# EAGLE design schematic (EAGLE 6.5.0)
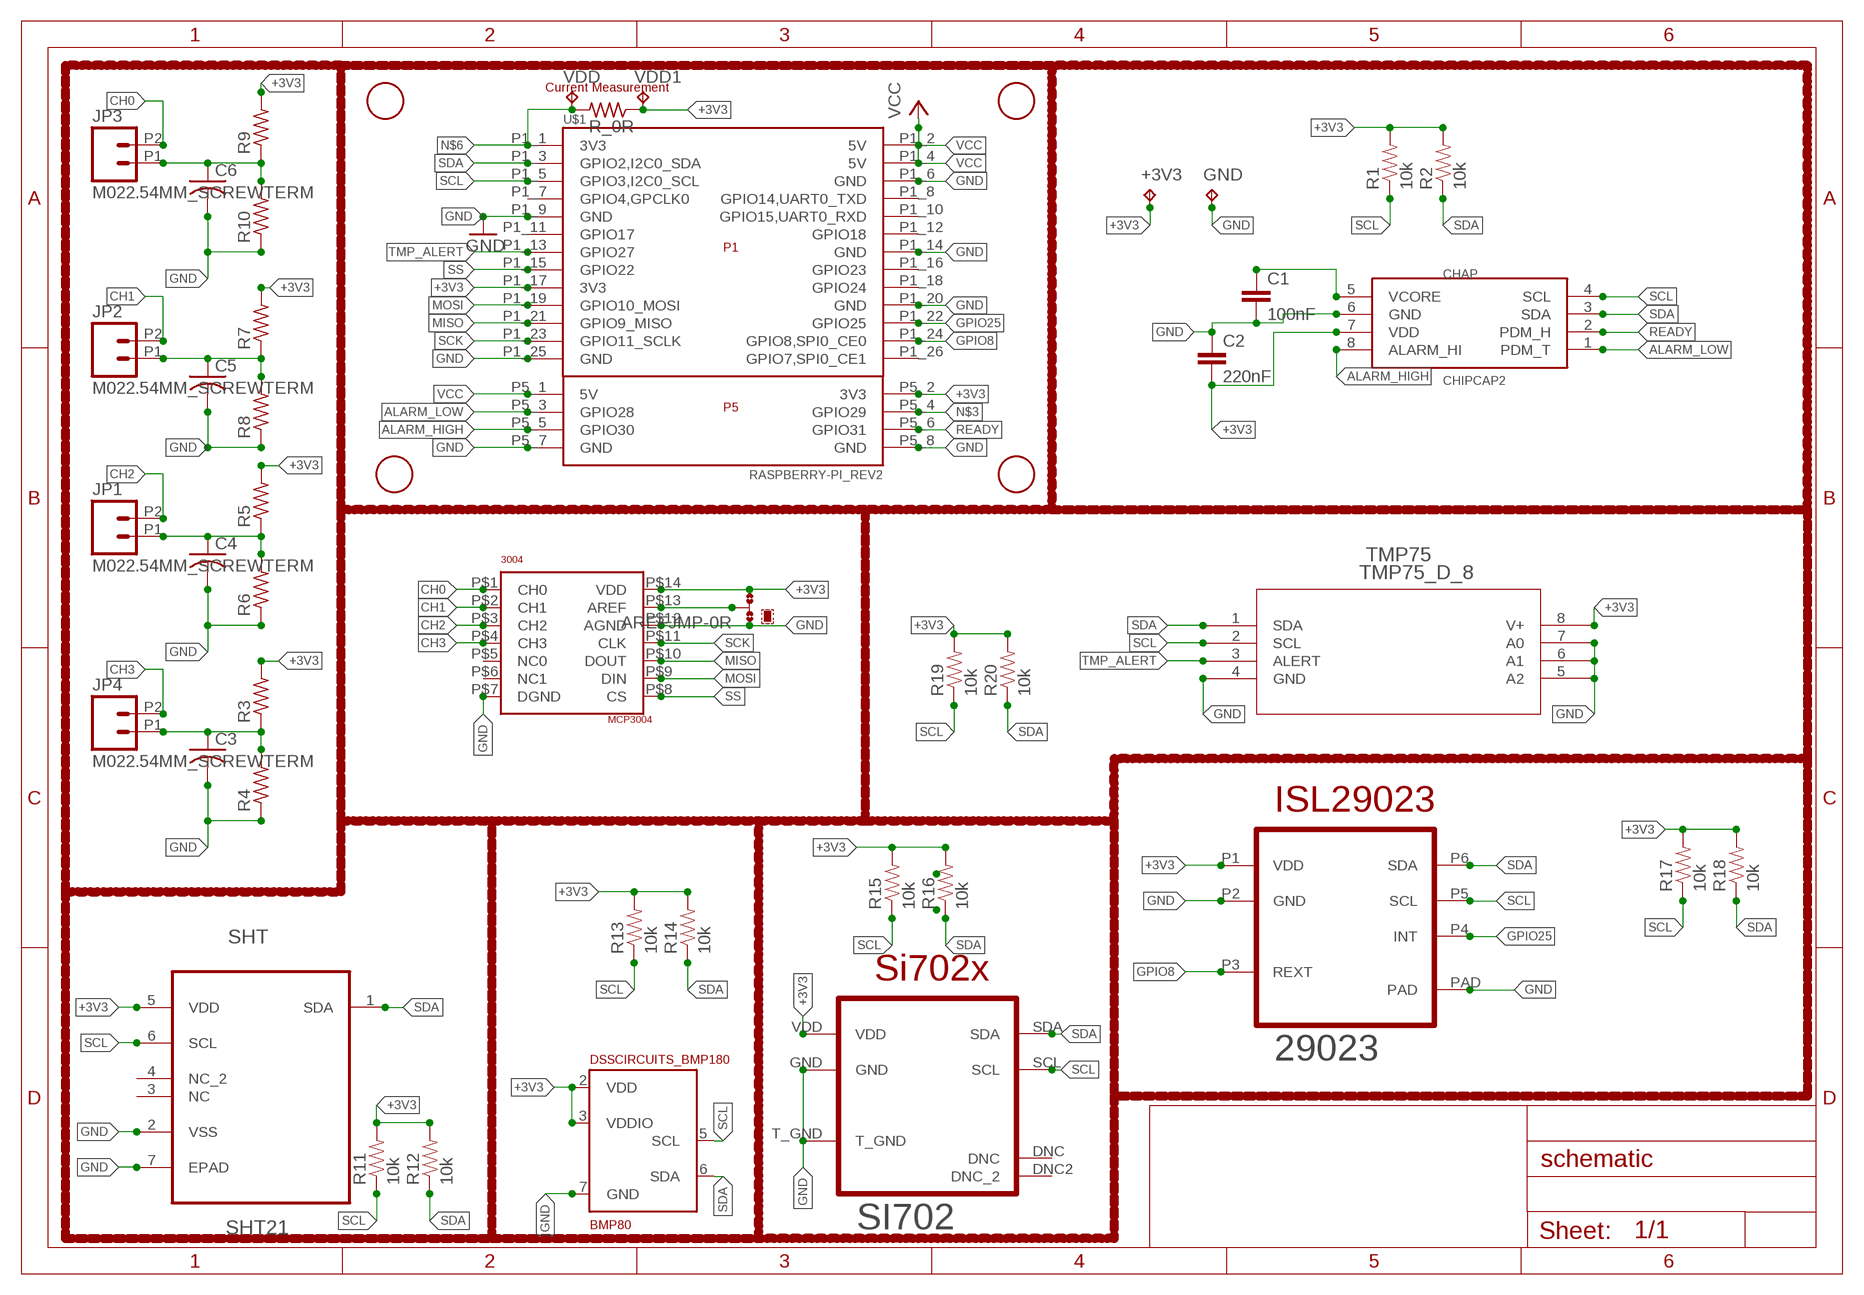
[diagram p0: schematic, sheet 1]

## Parts
3004  MCP3004  [TSSOP14_4MM4]
29023  ISL29023  [ODFN6]
+3V3  TPTP20R  [TP20R]
AREFJMP  0R-JUMPA  [A0R-JMP]
BMP80  DSSCIRCUITS_BMP180  [DSSCIRCUITS_LGA7]
C1  100nF  CAP0402-CAP  [0402-CAP]
C2  220nF  CAP0402-CAP  [0402-CAP]
C3  C-USC0402  [C0402]
C4  C-USC0402  [C0402]
C5  C-USC0402  [C0402]
C6  C-USC0402  [C0402]
CHAP  CHIPCAP2  [CHIPCAP2]
GND  TPTP20R  [TP20R]
JP1  M022.54MM_SCREWTERM  [1X02_2.54_SCREWTERM]
JP2  M022.54MM_SCREWTERM  [1X02_2.54_SCREWTERM]
JP3  M022.54MM_SCREWTERM  [1X02_2.54_SCREWTERM]
JP4  M022.54MM_SCREWTERM  [1X02_2.54_SCREWTERM]
R1  10k  RESISTOR0603  [0603-RES]
R2  10k  RESISTOR0603  [0603-RES]
R3  R-US_R0402  [R0402]
R4  R-US_R0402  [R0402]
R5  R-US_R0402  [R0402]
R6  R-US_R0402  [R0402]
R7  R-US_R0402  [R0402]
R8  R-US_R0402  [R0402]
R9  R-US_R0402  [R0402]
R10  R-US_R0402  [R0402]
R11  10k  RESISTOR0603  [0603-RES]
R12  10k  RESISTOR0603  [0603-RES]
R13  10k  RESISTOR0603  [0603-RES]
R14  10k  RESISTOR0603  [0603-RES]
R15  10k  RESISTOR0603  [0603-RES]
R16  10k  RESISTOR0603  [0603-RES]
R17  10k  RESISTOR0603  [0603-RES]
R18  10k  RESISTOR0603  [0603-RES]
R19  10k  RESISTOR0603  [0603-RES]
R20  10k  RESISTOR0603  [0603-RES]
R_0R  R-US_R0402  [R0402]
SHT  SHT21  [DFN300X300X110-7N]
SI702  SI702X  [DFN6]
TMP75  TMP75_D_8  [D8]
U$1  RASPBERRY-PI_REV2  [RASPBERRY-PI_REV2]
U$2  FIDUCIAL  [FIDUCIAL_1MM]
U$3  FIDUCIAL  [FIDUCIAL_1MM]
U$4  FIDUCIAL  [FIDUCIAL_1MM]
U$5  FIDUCIAL  [FIDUCIAL_1MM]
VDD  TPTP20R  [TP20R]
VDD1  TPTP20R  [TP20R]

## Nets
+3V3 [PWR]: 3004.P$14(VDD) 29023.P1(VDD) +3V3.TP AREFJMP.3 BMP80.2(VDD) BMP80.3(VDDIO) C2.2 CHAP.7(VDD) R1.2 R2.2 R3.2 R5.2 R7.2 R9.2 R11.2 R12.2 R13.2 R14.2 R15.2 R16.2 R17.2 R18.2 R19.2 R20.2 R_0R.1 SHT.5(VDD) SI702.VDD TMP75.8(V+) U$1.P1_17(3V3) U$1.P5_2(3V3) VDD1.TP
ALARM_HIGH: CHAP.8(ALARM_HI) U$1.P5_5(GPIO30)
ALARM_LOW: CHAP.1(PDM_T) U$1.P5_3(GPIO28)
CH0: 3004.P$1(CH0) JP3.P2
CH1: 3004.P$2(CH1) JP2.P2
CH2: 3004.P$3(CH2) JP1.P2
CH3: 3004.P$4(CH3) JP4.P2
GND [PWR]: 3004.P$7(DGND) 3004.P$12(AGND) 29023.P2(GND) 29023.PAD AREFJMP.1 BMP80.7(GND) C1.2 C2.1 C3.2 C4.2 C5.2 C6.2 CHAP.6(GND) GND.TP R4.1 R6.1 R8.1 R10.1 SHT.2(VSS) SHT.7(EPAD) SI702.GND SI702.T_GND TMP75.4(GND) TMP75.5(A2) TMP75.6(A1) TMP75.7(A0) U$1.P1_6(GND) U$1.P1_9(GND) U$1.P1_14(GND) U$1.P1_20(GND) U$1.P1_25(GND) U$1.P5_7(GND) U$1.P5_8(GND)
GPIO8: 29023.P3(REXT) U$1.P1_24(GPIO8,SPI0_CE0)
GPIO25: 29023.P4(INT) U$1.P1_22(GPIO25)
MISO: 3004.P$10(DOUT) U$1.P1_21(GPIO9_MISO)
MOSI: 3004.P$9(DIN) U$1.P1_19(GPIO10_MOSI)
N$1: C4.1 JP1.P1 R5.1 R6.2
N$2: C5.1 JP2.P1 R7.1 R8.2
N$3: U$1.P5_4(GPIO29)
N$4: C6.1 JP3.P1 R9.1 R10.2
N$5: C1.1 CHAP.5(VCORE)
N$6 [PWR]: R_0R.2 U$1.P1_1(3V3) VDD.TP
N$12: C3.1 JP4.P1 R3.1 R4.2
N$17: 3004.P$13(AREF) AREFJMP.2
READY: CHAP.2(PDM_H) U$1.P5_6(GPIO31)
SCK: 3004.P$11(CLK) U$1.P1_23(GPIO11_SCLK)
SCL: 29023.P5(SCL) BMP80.5(SCL) CHAP.4(SCL) R1.1 R11.1 R13.1 R15.1 R17.1 R19.1 SHT.6(SCL) SI702.SCL TMP75.2(SCL) U$1.P1_5(GPIO3,I2C0_SCL)
SDA: 29023.P6(SDA) BMP80.6(SDA) CHAP.3(SDA) R2.1 R12.1 R14.1 R16.1 R18.1 R20.1 SHT.1(SDA) SI702.SDA TMP75.1(SDA) U$1.P1_3(GPIO2,I2C0_SDA)
SS: 3004.P$8(CS) U$1.P1_15(GPIO22)
TMP_ALERT: TMP75.3(ALERT) U$1.P1_13(GPIO27)
VCC [PWR]: U$1.P1_2(5V) U$1.P1_4(5V) U$1.P5_1(5V)
Unconnected: 3004.P$5(NC0) 3004.P$6(NC1) BMP80.1 BMP80.4 SHT.3(NC) SHT.4(NC_2) SI702.DNC SI702.DNC2(DNC_2) U$1.P1_7(GPIO4,GPCLK0) U$1.P1_8(GPIO14,UART0_TXD) U$1.P1_10(GPIO15,UART0_RXD) U$1.P1_11(GPIO17) U$1.P1_12(GPIO18) U$1.P1_16(GPIO23) U$1.P1_18(GPIO24) U$1.P1_26(GPIO7,SPI0_CE1)

## Notes on the sheet
- Current Measurement

## Library data of the parts
3004 = lib:MCP3004: The Microchip Technology Inc. MCP3004/3008 devices are successive approximation 10-bit Analogto-Digital (A/D) converters with on-board sample and hold circuitry. The MCP3004 is programmable to provide two pseudo-differential input pairs or four single-ended inputs. The MCP3008 is programmable to provide four pseudo-differential input pairs or eight single-ended inputs. Differential Nonlinearity (DNL) and Integral Nonlinearity (INL) are specified at ±1 LSB. Communication with the devices is accomplished using a simple serial interface compatible with the SPI protocol. The devices are capable of conversion rates of up to 200 ksps. The MCP3004/3008 devices operate over a broad voltage range (2.7V - 5.5V). Low-current design permits operation with typical standby currents of only 5 nA and typical active currents of 320 µA. The MCP3004 is offered in 14-pin PDIP, 150 mil SOIC and TSSOP packages, while the MCP3008 is offered in 16-pin PDIP and SOIC packages. Features • 10-bit resolution • ± 1 LSB max DNL • ± 1 LSB max INL • 4 (MCP3004) or 8 (MCP3008) input channels • Analog inputs programmable as single-ended or pseudo-differential pairs • On-chip sample and hold • SPI serial interface (modes 0,0 and 1,1) • Single supply operation: 2.7V - 5.5V • 200 ksps max. sampling rate at VDD=5V • 75 ksps max. sampling rate at VDD=2.7V • Low power CMOS technology • 5 nA typical standby current, 2 µA max. • 500 µA max. active current at 5V • Industrial temp range: -40°C to +85°C • Available in PDIP, SOIC and TSSOP packages
29023 = weatherpilot_lbr:ISL29023
+3V3 GND VDD VDD1 = testpad:TP: Test pad
AREFJMP = jump-0r-smd:0R-JUMP: SMD 0R 0805 Jumper
BMP80 = BMP180_Breakout_PCB_Rev_B:DSSCIRCUITS_BMP180
C1 C2 = weatherpilot_lbr:CAP: Capacitor Standard 0603 ceramic capacitor, and 0.1" leaded capacitor.
C3-C6 = rcl:C-US: CAPACITOR, American symbol
CHAP = lib:CHIPCAP2
JP1-JP4 = SparkFun-Connectors:M02: Standard 2-pin 0.1" header. Use with - straight break away headers ( PRT-00116) - right angle break away headers (PRT-00553) - swiss pins (PRT-00743) - machine pins (PRT-00117) - female headers (PRT-00115) Molex polarized connector foot print use with: PRT-08233 with associated crimp pins and housings. 2.54_SCREWTERM for use with PRT-10571. 3.5mm Screw Terminal footprints for PRT-08084 5mm Screw Terminal footprints for use with PRT-08433
R1 R2 R11-R20 = SparkFun-Resistors:RESISTOR: Resistor Basic schematic elements and footprints for 0603, 1206, and PTH resistors.
R3-R10 R_0R = rcl:R-US_: RESISTOR, American symbol
SHT = weatherpilot_lbr:SHT21: SENSOR, HUMIDITY & TEMP; MPN: SHT21; OC_FARNELL: 1855468; OC_NEWARK: 20T1172; PACKAGE: DFN-6; SUPPLIER: SENSIRION
SI702 = weatherpilot_lbr:SI702X
TMP75 = libraryPart:TMP75_D_8; DATASHEETURL: http://www.ti.com/lit/gpn/TMP75; DESCRIPTION: Digital Temperature Sensor with 2-Wire Interface; FAMILY_NAME: TEMPERATURE SENSOR; GENERIC_PART_NUMBER: TMP75; INDUSTRY_STD_PKG_TYPE: SOIC; MANUFACTURER: Texas Instruments; MANUFACTURER_PART_NUMBER: tmp75_d_8; PACKAGE_DESIGNATOR: D; PIN_COUNT: 8; VENDOR: Texas Instruments
U$1 = RaspberryPi:RASPBERRY-PI_REV2: Raspberry Pi Board <http://www.raspberrypi.org/> Jacques Lagnel V1.0 (beta) 2012 Mateusz Bawaj V1.1 (beta) 2012 Board dimension: Forum 3D model <http://www.raspberrypi.org/forum/general-discussion/mechanical-profile-3d-models?value=3d%20model&type=1&include=1&search=1&ret=all> The GPIO Connector (P1): http://elinux.org/RPi_Low-level_peripherals The GPIO Connector (P5): http://www.raspberrypi-spy.co.uk/2012/09/raspberry-pi-p5-header/
U$2-U$5 = adafruit:FIDUCIAL: For use by pick and place machines to calibrate the vision/machine, 1mm By microbuilder.eu

## Net classes
0 default: width 0.203 mm, drill 0.305 mm, clearance 0.152 mm
1 PWR: width 0.203 mm, drill 0.305 mm, clearance 0.152 mm

## Board
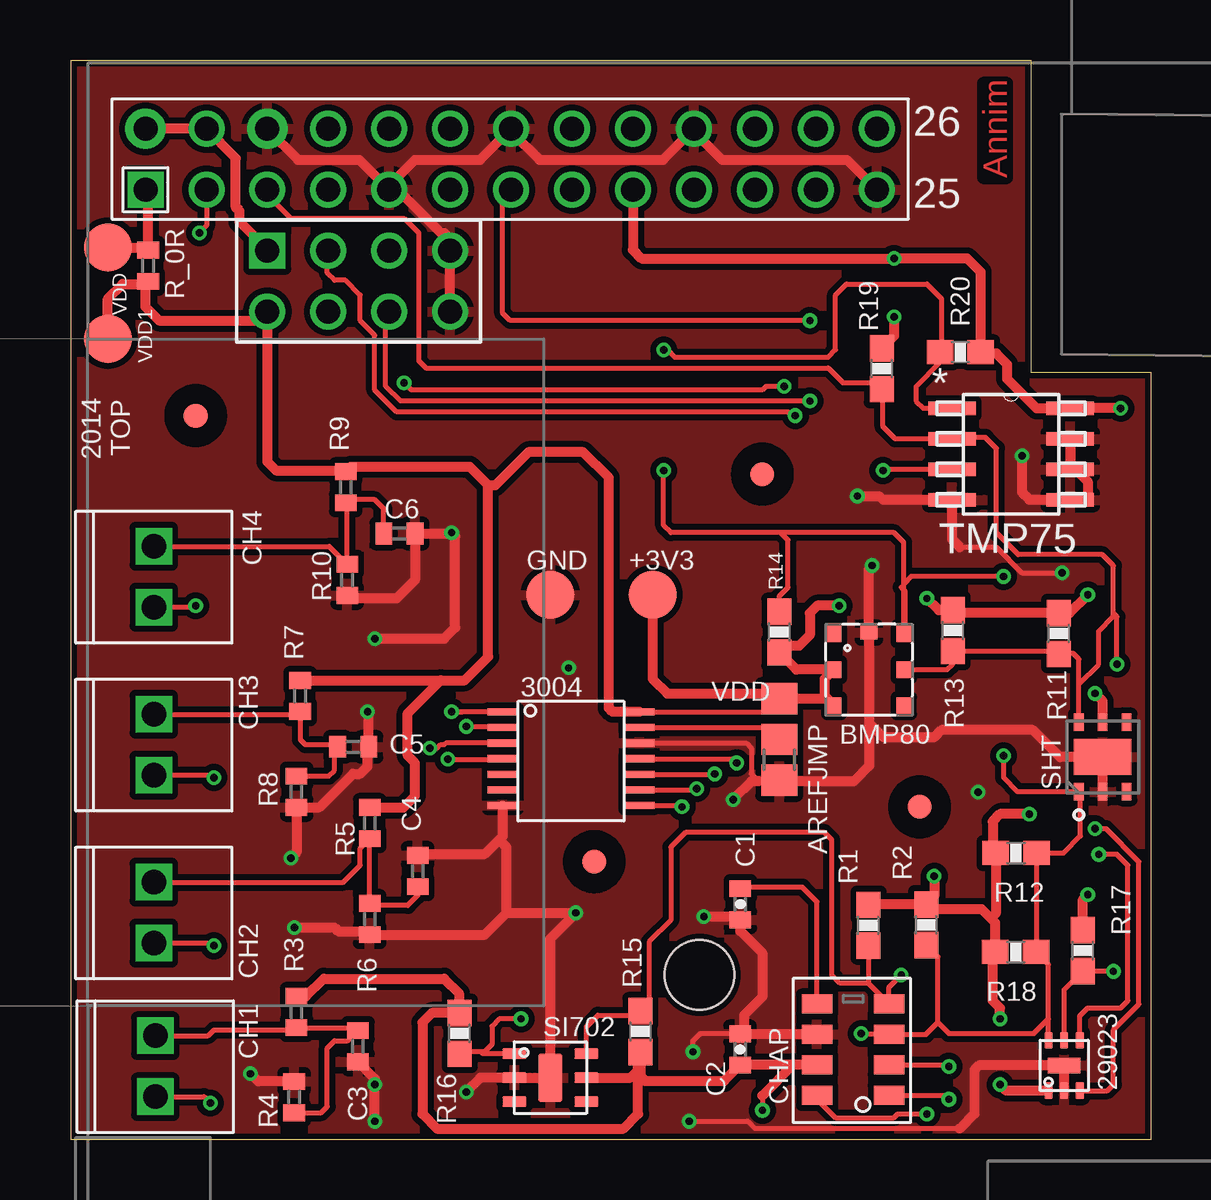
[diagram p1: board, top side]
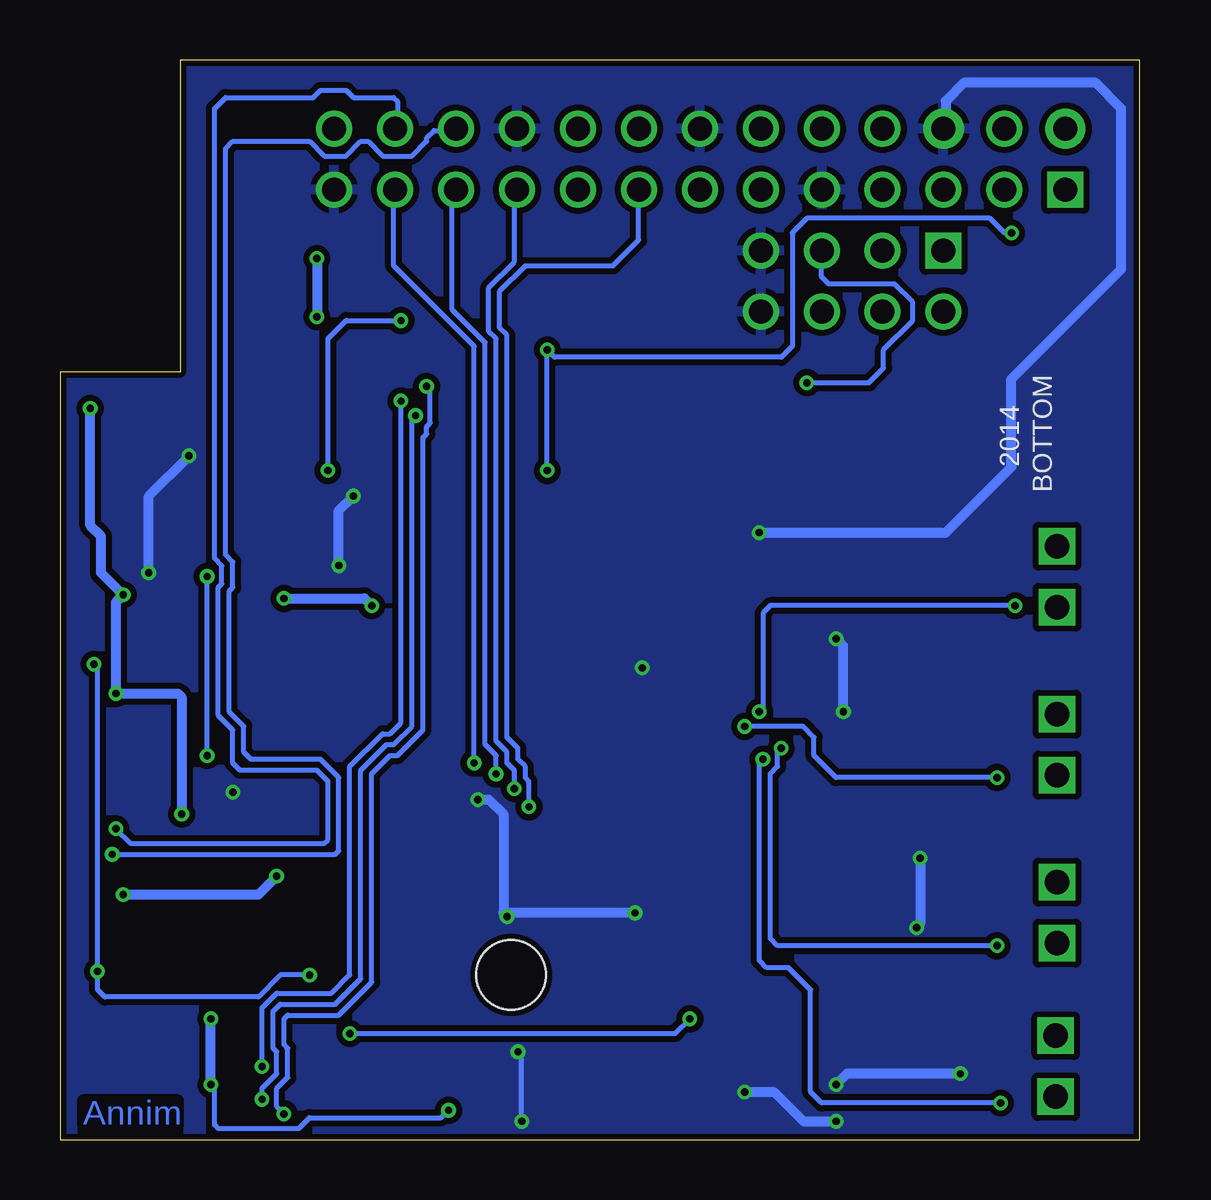
[diagram p2: board, bottom side, seen from below]

Size 45 x 45 mm. Coordinates in mm from the lower left corner, seen from the top.
Outline: 0,0 0,45 40,45 40,32 45,32 45,0 0,0
Copper layers (1*16): Top 0.035mm / dielectric 1.5mm / Bottom 0.035mm
Design rules "smart prototyping": minimum track width 6mil, minimum drill 12mil, track to track 6mil, track to pad 6mil, pad to pad 6mil, via to via 6mil, smd to smd 0mil, copper to edge 10mil, drill to drill 10mil, minimum pad ring 6mil, minimum via ring 6mil, stop-mask expansion 2mil, vias tented up to drill 25mil, thermal gap 10mil

### Footprints (pad centres in the part's own frame; a part is rotated, then mirrored left to right if it is on the bottom)
TSSOP14_4MM4 = smd 1.25 x 0.3: P$1 -0.65,4.55; P$2 -0.65,3.9; P$3 -0.65,3.25; P$4 -0.65,2.6; P$5 -0.65,1.95; P$6 -0.65,1.3; P$7 -0.65,0.65; P$8 5.05,0.65; P$9 5.05,1.3; P$10 5.05,1.95; P$11 5.05,2.6; P$12 5.05,3.25; P$13 5.05,3.9; P$14 5.05,4.55
ODFN6 = smd 0.7 x 0.35: P1 -1.05,0.65; P2 -1.05,0; P3 -1.05,-0.65; P4 1.05,-0.65; P5 1.05,0; P6 1.05,0.65 | smd 0.65 x 1.35: PAD 0,0
TP20R = smd 2 x 2: TP 0,0
A0R-JMP = smd 1.5 x 1.3: 1 0,1.7; 2 0,0; 3 0,-1.7
DSSCIRCUITS_LGA7 = smd 0.7 x 0.6: 1 -1.5,-1.45; 2 0,-1.45; 3 1.5,-1.45; 4 1.5,1.45; 5 0,1.45; 6 -1.5,1.45 | smd 0.6 x 0.7: 7 -1.55,0
0402-CAP = smd 0.7 x 0.9: 1 -0.65,0; 2 0.65,0
C0402 = smd 0.7 x 0.9: 1 -0.65,0; 2 0.65,0
CHIPCAP2 = smd 1.27 x 0.8: 1 1.603,-1.651; 2 1.603,-0.381; 3 1.603,0.889; 4 1.603,2.159; 5 -1.397,2.159; 6 -1.397,0.889; 7 -1.397,-0.381; 8 -1.397,-1.651
1X02_2.54_SCREWTERM = drill 1.016 square: P1 2.54,0; P2 0,0
0603-RES = smd 1.1 x 1: 1 -0.85,0; 2 0.85,0
R0402 = smd 0.7 x 0.9: 1 -0.65,0; 2 0.65,0
DFN300X300X110-7N = smd 0.711 x 0.406: 1 -1.448,0.991; 2 -1.448,0; 3 -1.448,-0.991; 4 1.448,-0.991; 5 1.448,0; 6 1.448,0.991 | smd 1.499 x 2.388: 7 0,0
DFN6 = smd 1 x 0.45: DNC -1.5,-1; DNC2 1.5,-1; GND -1.5,0; SCL 1.5,1; SDA -1.5,1; VDD 1.5,0 | smd 1 x 2: T_GND 0,0
D8 = smd 1.981 x 0.559: 1 -2.464,1.905; 2 -2.464,0.635; 3 -2.464,-0.635; 4 -2.464,-1.905; 5 2.464,-1.905; 6 2.464,-0.635; 7 2.464,0.635; 8 2.464,1.905
RASPBERRY-PI_REV2 = drill 1 square: P1_1 -41.91,21.59; P5_1 -36.83,19.05 | drill 1 pad 1.676: P1_2 -41.91,24.13; P1_6 -36.83,24.13 | drill 1: P1_3 -39.37,21.59; P1_4 -39.37,24.13; P1_5 -36.83,21.59; P1_7 -34.29,21.59; P1_8 -34.29,24.13; P1_9 -31.75,21.59; P1_10 -31.75,24.13; P1_11 -29.21,21.59; P1_12 -29.21,24.13; P1_13 -26.67,21.59; P1_14 -26.67,24.13; P1_15 -24.13,21.59; P1_16 -24.13,24.13; P1_17 -21.59,21.59; P1_18 -21.59,24.13; P1_19 -19.05,21.59; P1_20 -19.05,24.13; P1_21 -16.51,21.59; P1_22 -16.51,24.13; P1_23 -13.97,21.59; P1_24 -13.97,24.13; P1_25 -11.43,21.59; P1_26 -11.43,24.13; P5_2 -36.83,16.51; P5_3 -34.29,19.05; P5_4 -34.29,16.51; P5_5 -31.75,19.05; P5_6 -31.75,16.51; P5_7 -29.21,19.05; P5_8 -29.21,16.51 | hole 2.9: -18.81,-11.135
FIDUCIAL_1MM = smd 1 x 1: 1 0,0

### Placement (x,y rotation side)
3004  18.63,13.27 0 top
29023  41.38,3.09 90 top
+3V3  24.23,22.71 0 top
AREFJMP  29.51,16.68 180 top
BMP80  33.25,19.59 270 top
C1  27.88,9.81 270 top
C2  27.88,3.76 270 top
C3  11.95,3.89 270 top
C4  14.44,11.19 90 top
C5  11.75,16.37 0 top
C6  13.67,25.26 0 top
CHAP  32.48,3.49 0 top
GND  19.96,22.71 0 top
JP1  3.44,8.19 90 top
JP2  3.44,15.19 90 top
JP3  3.44,22.19 90 top
JP4  3.5,1.79 90 top
R1  33.23,8.93 90 top
R2  35.64,8.95 90 top
R3  9.38,5.31 90 top
R4  9.29,1.77 270 top
R5  12.44,13.19 90 top
R6  12.44,9.19 90 top
R7  9.54,18.49 90 top
R8  9.38,14.5 90 top
R9  11.44,27.19 90 top
R10  11.5,23.33 90 top
R11  41.16,21.09 90 top
R12  39.38,11.95 180 top
R13  36.74,21.22 90 top
R14  29.51,21.15 270 top
R15  23.72,4.5 270 top
R16  16.19,4.42 90 top
R17  42.16,7.87 90 top
R18  39.36,7.81 180 top
R19  33.78,32.13 90 top
R20  37.06,32.82 0 top
R_0R  3.2,36.42 90 top
SHT  42.99,15.95 90 top
SI702  19.97,2.58 0 top
TMP75  39.17,28.57 0 top
U$1  45,18 0 top
U$2  5.18,30.18 0 top
U$3  21.79,11.58 0 top
U$4  28.8,27.74 0 top
U$5  35.36,13.87 0 top
VDD  1.52,37.19 0 top
VDD1  1.52,33.38 0 top

### Tracks (layer width: path | path; a pad name or v marks a point on that pad's centre or on a via)
+3V3  (via drill 0.3)
  Top 0.203: 3004.P$14 28.96,17.82 AREFJMP.3 | 28.8,1.83 v28.8,1.22
  Top 0.406: R3.2 9.77,5.96 10.52,6.71 15.54,6.71 16.15,6.1 16.15,5.3 R16.2 15.03,5.27 14.63,4.88 14.63,1.07 15.24,0.46 23.01,0.46 23.62,1.07 23.62,2.9 | SI702.VDD 23.3,2.58 23.62,2.9 | 23.62,2.9 23.62,3.56 R15.2 23.72,2.65 23.93,2.44 27.21,2.44 C2.2 CHAP.7 30.09,3.11 28.8,1.83 | 29023.P1 38.96,2.04 v38.71,2.29 | v38.71,5.03 38.71,5.49 38.41,5.79 38.41,7.71 R18.2 38.51,9.04 38.33,9.22 | 38.33,9.22 37.95,9.6 35.83,9.6 R2.2 | R2.2 33.24,9.8 R1.2 | 38.33,9.22 38.53,9.42 R12.2 38.41,12.07 38.41,13.26 38.71,13.56 v39.93,13.56 | SHT.5 42.99,18.28 v42.67,18.59 | v42.37,22.71 41.6,21.94 R11.2 36.87,21.94 R13.2 36.15,22.07 v35.66,22.55 | v43.74,30.48 TMP75.8 40.24,30.48 39.01,31.7 39.01,32.31 38.56,32.77 37.96,32.77 R20.2 37.91,36.16 37.34,36.73 v34.29,36.73 23.77,36.73 23.41,37.09 U$1.P1_17 | v34.29,34.29 34.29,33.49 R19.2 | v32,22.25 31.09,22.25 30.79,21.95 30.79,21.03 30.33,20.57 29.78,20.57 R14.2 30.22,19.59 BMP80.2 31.78,19.59 31.39,19.2 31.39,18.49 BMP80.3 31.5,18.38 AREFJMP.3 29.3,18.59 24.84,18.59 24.23,19.2 +3V3.TP | R7.2 15.39,19.14 | 15.39,19.14 16.39,19.14 17.37,20.12 17.37,27.28 | 17.37,27.28 16.61,28.04 11.64,28.04 R9.2 11.39,27.89 8.53,27.89 8.17,28.25 U$1.P5_2 7.8,34.14 3.66,34.14 3.09,34.7 3.09,35.66 R_0R.1 3.09,35.66 2.13,35.66 1.52,35.05 VDD1.TP | R5.2 13.84,13.84 14.33,14.33 14.33,15.7 14.02,16 14.02,17.77 15.39,19.14 | R17.2 42.16,10.01 v42.37,10.21 | v35.97,10.97 35.97,10.13 R2.2 | 3004.P$14 22.56,17.82 22.4,17.98 22.4,27.58 21.34,28.65 19.05,28.65 17.68,27.28 17.37,27.28
  Bottom 0.203: v38.71,2.29 38.56,2.13 38.56,0.61 38.41,0.46 35.05,0.46 34.59,0.91 29.11,0.91 v28.8,1.22
  Bottom 0.406: v38.71,2.29 v38.71,5.03 | v39.93,13.56 39.93,18.44 40.08,18.59 v42.67,18.59 42.67,22.4 v42.37,22.71 43.28,23.62 43.28,25.15 43.74,25.6 v43.74,30.48 | v34.29,36.73 v34.29,34.29 | v35.66,22.55 32.31,22.55 v32,22.25 | v42.37,10.21 36.73,10.21 v35.97,10.97
ALARM_HIGH  (via drill 0.3)
  Top 0.203: CHAP.8 31.09,1.68 31.85,0.91 34.29,0.91 34.44,1.07 v35.66,1.07 | v29.72,31.39 28.96,31.39 28.8,31.24 14.17,31.24 v13.87,31.55
  Bottom 0.203: v35.66,1.07 35.97,1.37 35.97,2.13 35.51,2.59 35.51,3.81 35.66,3.96 35.66,5.03 35.51,5.18 33.38,5.18 32,6.55 32,15.24 31.24,16 30.94,16 29.87,17.07 29.87,29.26 29.72,29.41 29.72,29.72 29.57,29.87 29.57,31.24 v29.72,31.39 | v13.87,31.55 11.28,31.55 10.67,32.16 10.67,32.92 9.45,34.14 9.45,34.9 10.21,35.66 12.95,35.66 13.26,35.97 U$1.P5_5
ALARM_LOW  (via drill 0.3)
  Top 0.203: CHAP.1 36.41,1.84 v36.58,1.68 | v30.18,30.18 30.02,30.18 29.87,30.33 13.56,30.33 12.65,31.24 12.65,33.53 12.04,34.14 12.04,35.2 11.43,35.81 10.97,35.81 10.67,36.12 10.67,37.01 U$1.P5_3
  Bottom 0.203: v36.58,1.68 36.58,2.13 35.97,2.74 35.97,3.66 36.12,3.81 36.12,5.33 35.81,5.64 33.53,5.64 32.46,6.71 32.46,15.39 31.39,16.46 31.09,16.46 30.33,17.22 30.33,30.02 v30.18,30.18
CH0  (via drill 0.3)
  Top 0.203: JP3.P2 5.12,22.19 v5.18,22.25 | 16.31,17.83 v15.85,17.83 v15.86,17.82 3004.P$1
  Bottom 0.203: v5.18,22.25 15.39,22.25 15.7,21.95 15.7,17.98 v15.85,17.83
CH1  (via drill 0.3)
  Top 0.203: JP2.P2 5.84,15.19 v5.94,15.09 | v16.46,17.22 17.93,17.22 3004.P$2
  Bottom 0.203: v5.94,15.09 12.65,15.09 13.56,16 13.56,16.76 14.02,17.22 v16.46,17.22
CH2  (via drill 0.3)
  Top 0.203: JP1.P2 5.83,8.19 v5.94,8.08 | v14.94,16.31 15.24,16.31 15.39,16.46 15.54,16.46 15.61,16.52 3004.P$3
  Bottom 0.203: v5.94,8.08 15.09,8.08 15.39,8.38 15.39,15.24 15.09,15.54 15.09,16.15 v14.94,16.31
CH3  (via drill 0.3)
  Top 0.203: JP4.P2 5.53,1.79 v5.79,1.52 | v15.7,15.85 17.95,15.85 3004.P$4
  Bottom 0.203: v5.79,1.52 13.26,1.52 13.72,1.98 13.72,6.25 14.63,7.16 15.54,7.16 15.85,7.47 15.85,15.7 v15.7,15.85
GND  (via drill 0.3)
  Top 0.203: 3004.P$12 28.13,16.52 28.35,16.31 28.35,15.24 28.65,14.94 29.47,14.94 AREFJMP.1 | 37.03,0.46 28.5,0.46 28.19,0.76 v25.76,0.76 | v25.91,3.66 25.91,4.12 26.21,4.42 27.86,4.42 C2.1 | 37.03,24.69 38.56,24.69 39.62,23.62 v41.3,23.62
  Top 0.406: R4.1 7.79,2.42 v7.47,2.74 | C3.2 12.65,2.54 v12.65,2.29 v12.65,0.76 | v16.46,1.98 17.05,2.58 SI702.GND SI702.T_GND 19.97,8.38 v21.03,9.45 18.14,9.45 | v26.36,9.3 27.74,9.3 C1.2 27.88,8.69 28.8,7.77 28.8,5.94 28.04,5.18 28.04,4.57 C2.1 27.9,4.38 CHAP.6 | 37.03,0.46 37.64,1.07 37.64,2.9 37.84,3.09 29023.PAD 29023.P2 | 28.65,14.94 28.35,14.94 v27.58,14.17 | v33.38,23.93 33.25,23.8 BMP80.7 33.25,17.37 | v32.77,26.82 33.68,26.82 33.83,26.67 TMP75.4 36.7,25.02 37.03,24.69 | 33.25,17.37 33.25,15.57 32.61,14.94 29.56,14.94 AREFJMP.1 | 33.25,17.37 33.86,16.76 35.97,16.76 36.27,17.07 40.08,17.07 41.2,15.95 SHT.7 SHT.2 | v39.62,28.5 39.62,26.98 39.93,26.67 TMP75.5 42.22,26.67 42.37,26.82 42.37,27.43 41.86,27.94 TMP75.6 TMP75.7 | R10.1 11.62,22.55 13.56,22.55 14.32,23.32 C6.2 15.81,25.26 v15.85,25.3 16,25.15 16,21.34 15.54,20.88 v12.65,20.88 | 3004.P$7 17.98,12.64 17.83,12.5 | 17.83,12.5 17.22,11.89 14.49,11.89 C4.2 | 18.14,9.45 17.22,8.54 R6.1 12.29,8.69 11.12,8.69 10.97,8.84 v9.3,8.84 | 18.14,9.45 18.14,12.19 17.83,12.5 | U$1.P5_8 U$1.P5_7 15.85,37.11 15.85,37.49 15.54,37.8 15.39,37.8 13.6,39.59 U$1.P1_9 | U$1.P1_6 9.45,40.84 12,40.84 U$1.P1_9 | U$1.P1_9 13.25,39.77 14.33,40.84 17.04,40.84 U$1.P1_14 18.33,42.02 19.51,40.84 24.66,40.84 U$1.P1_20 25.95,42.02 27.13,40.84 32.32,40.84 U$1.P1_25 | v12.34,17.83 12.4,17.78 C5.2 12.34,16.32 12.34,15.54 12.04,15.24 11.73,15.24 10.34,13.85 R8.1 9.38,11.97 v9.14,11.73
  Bottom 0.203: v25.76,0.76 25.76,3.5 v25.91,3.66
  Bottom 0.406: v7.47,2.74 12.19,2.74 v12.65,2.29 | v16.46,1.98 15.24,1.98 14.02,0.76 v12.65,0.76 | v21.03,9.45 26.21,9.45 v26.36,9.3 26.52,9.45 26.52,13.56 27.13,14.17 v27.58,14.17 | v33.38,23.93 33.38,26.21 v32.77,26.82 | v41.3,23.62 41.3,26.82 v39.62,28.5 | v15.85,25.3 8.08,25.3 5.33,28.04 5.33,31.7 0.76,36.27 0.76,42.98 1.83,44.04 7.32,44.04 8.08,43.28 8.08,42.22 U$1.P1_6 | v12.34,17.83 12.34,20.57 v12.65,20.88 | v9.14,11.73 9.14,8.99 v9.3,8.84
  other vias: 37.8,14.48 20.73,19.66
  pour Top (isolate 0.254): -5.64,49.53 51.21,49.53 51.21,-4.42 -5.64,-4.42
  pour Bottom (isolate 0.254): -7.47,52.58 54.71,52.58 54.71,-6.55 -7.47,-6.55
GPIO8  (via drill 0.3)
  Top 0.203: 29023.P3 43.19,2.04 43.43,2.29 43.43,4.57 44.5,5.64 44.5,11.58 43.13,12.95 v42.67,12.95
  Bottom 0.203: v42.67,12.95 42.06,12.34 33.98,12.34 33.83,12.5 33.83,14.94 34.29,15.39 37.49,15.39 37.8,15.7 37.8,17.07 38.41,17.68 38.41,23.01 38.25,23.16 38.25,23.93 38.56,24.23 38.56,42.98 38.1,43.43 34.44,43.43 34.14,43.74 33.07,43.74 32.77,43.43 31.09,43.43 30.94,43.28 30.94,42.22 U$1.P1_24
GPIO25  (via drill 0.3)
  Top 0.203: 29023.P4 42.03,5.15 42.37,5.49 43.74,5.49 44.04,5.79 44.04,11.43 43.59,11.89 v42.82,11.89
  Bottom 0.203: v42.82,11.89 33.53,11.89 33.38,12.04 33.38,15.09 34.14,15.85 37.03,15.85 37.34,16.15 37.34,17.22 37.95,17.83 37.95,22.86 37.8,23.01 37.8,24.08 38.1,24.38 38.1,41.3 37.8,41.6 34.59,41.6 33.98,41 33.07,41 32.46,41.6 32.16,41.6 31.55,41 30.33,41 29.72,41.6 29.72,41.76 29.41,42.06 28.56,42.06 U$1.P1_22 28.35,42.27
MISO  (via drill 0.3)
  Top 0.203: 3004.P$10 26.81,15.22 v26.82,15.24
  Bottom 0.203: v26.82,15.24 26.82,16 27.28,16.46 27.28,33.22 28.65,34.59 28.65,39.43 U$1.P1_21
MOSI  (via drill 0.3)
  Top 0.203: 3004.P$9 26,14.57 v26.06,14.63
  Bottom 0.203: v26.06,14.63 26.06,15.39 26.36,15.7 26.36,16.15 26.82,16.61 26.82,33.38 27.13,33.68 27.13,35.51 26.06,36.58 26.06,39.48 U$1.P1_19
N$1
  Top 0.203: JP1.P1 11.34,10.73 12.04,11.43 12.04,12.14 R5.1 R6.2 12.52,9.75 14.02,9.75 14.44,10.17 C4.1
N$2
  Top 0.203: JP2.P1 9.43,17.73 R7.1 9.54,16.68 9.75,16.46 11.01,16.46 C5.1 10.97,16.25 10.97,15.39 10.73,15.15 R8.2
N$4
  Top 0.203: JP3.P1 10.75,24.73 R10.2 11.5,26.48 R9.1 11.57,26.67 12.65,26.67 13.02,26.3 C6.1
N$5
  Top 0.203: CHAP.5 31.09,9.91 30.48,10.52 27.94,10.52 C1.1
N$6
  Top 0.406: U$1.P1_1 3.2,39.48 R_0R.2 3.09,37.19 VDD.TP
N$12
  Top 0.203: JP4.P1 5.7,4.33 5.94,4.57 9.29,4.57 R3.1 11.82,4.66 C3.1 11.52,4.12 10.97,4.12 10.67,3.81 10.67,1.37 10.41,1.12 R4.2
N$17
  Top 0.203: 3004.P$13 29.02,17.17 AREFJMP.2
READY  (via drill 0.3)
  Top 0.203: CHAP.2 36.51,3.11 v36.58,3.05 | v30.79,30.79 13.72,30.79 13.11,31.39 13.11,34.37 U$1.P5_6
  Bottom 0.203: v36.58,3.05 36.58,5.49 35.97,6.1 33.68,6.1 32.92,6.86 32.92,15.54 31.55,16.92 31.24,16.92 30.79,17.37 v30.79,30.79
SCK  (via drill 0.3)
  Top 0.203: 3004.P$11 27.56,15.87 v27.74,15.7
  Bottom 0.203: v27.74,15.7 27.74,33.07 31.09,36.42 31.09,39.53 U$1.P1_23
SCL  (via drill 0.3)
  Top 0.203: U$1.P1_5 8.17,39.38 9.14,38.41 13.87,38.41 14.48,37.8 14.48,32.46 14.78,32.16 31.55,32.16 32.16,31.55 33.52,31.55 R19.1 33.83,31.23 33.83,29.72 34.34,29.21 TMP75.2 36.76,29.26 38.1,29.26 38.56,28.8 38.56,25.3 39.47,24.38 42.98,24.38 43.43,23.93 43.43,21.95 | BMP80.5 36.5,19.59 36.73,19.81 36.73,20.35 R13.1 41.04,20.36 R11.1 41.19,20.27 41.76,20.27 42,20.03 SHT.6 42,18.98 42.82,19.81 42.82,21.18 43.43,21.79 43.43,21.95 | 29023.P5 41.38,6.24 R17.1 43.42,7.03 v43.43,7.01 | v43.59,19.81 43.59,21.79 43.43,21.95 | v34.59,6.86 34.09,6.35 CHAP.4 33.23,6.51 | R1.1 33.23,6.51 | SI702.SCL 21.47,4.7 21.95,5.18 23.55,5.18 R15.1 24.08,5.71 24.08,8.23 24.99,9.14 24.99,12.19 25.6,12.8 31.39,12.8 31.7,12.5 31.7,6.86 32.04,6.51 33.23,6.51
  Bottom 0.203: v43.59,19.81 43.43,19.66 v43.43,7.01 43.43,6.25 43.13,5.94 36.73,5.94 35.81,6.86 v34.59,6.86
SDA  (via drill 0.3)
  Top 0.203: TMP75.1 35.51,30.48 35.2,30.79 35.2,31.39 36.21,32.4 R20.1 36.27,32.88 36.27,35.05 35.66,35.66 32.31,35.66 31.85,35.2 31.85,32.92 31.55,32.61 25.15,32.61 24.84,32.92 v24.69,32.92 | U$1.P1_3 5.63,38.09 v5.33,37.8 | R14.1 29.5,22.65 29.87,23.01 29.87,24.99 29.57,25.3 | 34.59,23.01 34.75,22.86 34.75,21.14 BMP80.6 34.7,23.16 | 34.7,23.16 34.7,24.89 34.29,25.3 29.57,25.3 | 29.57,25.3 24.99,25.3 24.69,25.6 v24.69,27.89 | v38.86,16 38.86,15.09 39.45,14.5 SHT.1 42.06,14.43 42.06,12.65 41.36,11.95 R12.1 40.23,7.83 R18.1 40.73,7.29 40.73,5.03 | v38.86,23.47 35,23.47 34.7,23.16 | 29023.P6 40.73,5.03 | 36.12,4.88 35.62,4.38 CHAP.3 32.96,4.38 v32.92,4.42 | 36.12,4.88 36.12,7.62 | 36.12,7.62 R2.1 36.12,7.62 | 36.12,4.88 36.58,4.42 40.12,4.42 40.73,5.03 | v18.75,5.03 17.83,5.03 17.53,4.72 17.53,3.96 17.22,3.66 17.07,3.66 | 17.07,3.66 16.27,3.66 R16.1 | SI702.SDA 17.15,3.58 17.07,3.66
  Bottom 0.203: v5.33,37.8 5.64,37.8 6.25,38.41 13.87,38.41 14.48,37.8 14.48,33.07 14.94,32.61 24.38,32.61 v24.69,32.92 v24.69,27.89 | v38.86,16 v38.86,23.47 | v32.92,4.42 19.36,4.42 v18.75,5.03
SS  (via drill 0.3)
  Top 0.203: 3004.P$8 25.4,13.92 v25.45,13.87
  Bottom 0.203: v25.45,13.87 25.45,14.94 25.6,15.09 25.6,15.54 25.91,15.85 25.91,16.31 26.36,16.76 26.36,33.53 26.67,33.83 26.67,35.36 25.6,36.42 21.95,36.42 20.88,37.49 U$1.P1_15
TMP_ALERT  (via drill 0.3)
  Top 0.203: TMP75.3 33.88,27.94 v33.83,27.89 | v30.79,34.14 18.29,34.14 17.98,34.44 17.98,39.24 U$1.P1_13
  Bottom 0.203: v33.83,27.89 33.83,33.38 33.07,34.14 v30.79,34.14
VCC
  Top 0.406: U$1.P5_1 8.17,37.09 7.01,38.25 7.01,38.71 6.86,38.86 6.86,40.9 U$1.P1_4 U$1.P1_2

### Text on the board
Top: Annim
Bottom: Annim
tNames: 2014 | TOP | CH4 | VDD | CH3 | CH2 | CH1
bNames: 2014 | BOTTOM